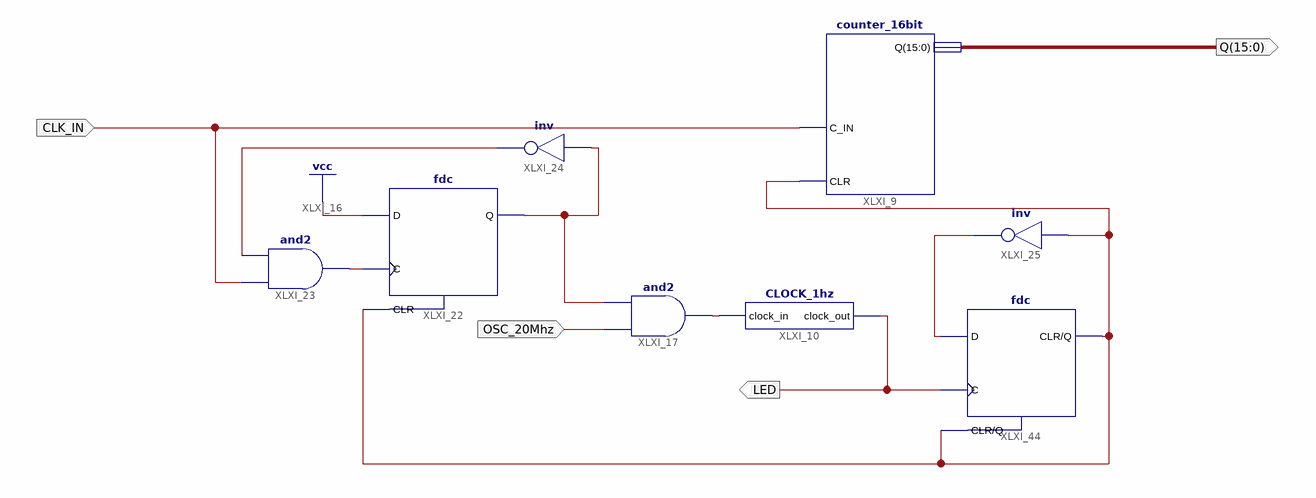
[diagram p0: schematic sheet 1]
// Xilinx ISE schematic freq_counter.sch (spartan6) as structural Verilog: 8 symbols, 4 ports
module freq_counter (
  input  CLK_IN,
  input  OSC_20Mhz,
  output LED,
  output [15:0] Q
);

  wire XLXN_101, XLXN_104, XLXN_106, XLXN_107, XLXN_163, XLXN_171;

  fdc XLXI_22 (.C(XLXN_104), .CLR(XLXN_171), .D(1'b1), .Q(XLXN_101));
  and XLXI_17 (XLXN_107, OSC_20Mhz, XLXN_101);
  and XLXI_23 (XLXN_104, CLK_IN, XLXN_106);
  not XLXI_24 (XLXN_106, XLXN_101);
  counter_16bit XLXI_9 (.C_IN(CLK_IN), .CLR(XLXN_171), .Q(Q));
  CLOCK_1hz XLXI_10 (.clock_in(XLXN_107), .clock_out(LED));
  fdc XLXI_44 (.C(LED), .CLR(XLXN_171), .D(XLXN_163), .Q(XLXN_171));
  not XLXI_25 (XLXN_163, XLXN_171);
endmodule
